# EAGLE design opto-mount (EAGLE 5.04)
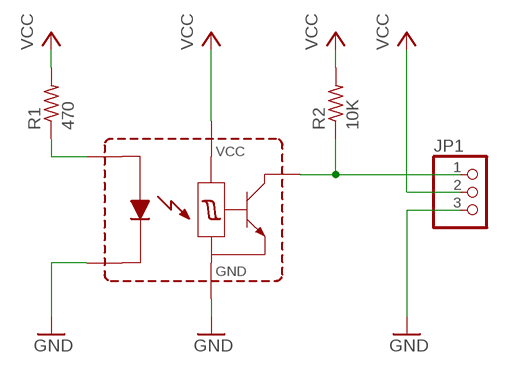
[diagram p0: schematic, sheet 1]

## Parts
JP1  PINHD-1X3  [1X03]
R1  470  R-US_R0805  [R0805]
R2  10K  R-US_R0402  [R0402]
U$1  H21LOB  [H21L]

## Nets
GND: JP1.3 U$1.P$2(K) U$1.P$5(GND)
N$1: R1.1 U$1.P$1(A)
N$2: JP1.1 R2.1 U$1.P$4(OUT)
VCC: JP1.2 R1.2 R2.2 U$1.P$3(VCC)

## Library data of the parts
JP1 = pinhead:PINHD-1X3: PIN HEADER
R1 R2 = rcl:R-US_: RESISTOR, American symbol
U$1 = H21L:H21LOB

## Board
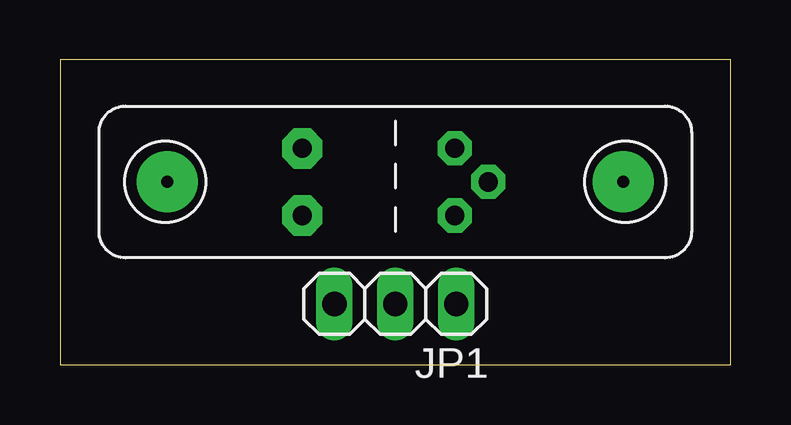
[diagram p1: board, top side]
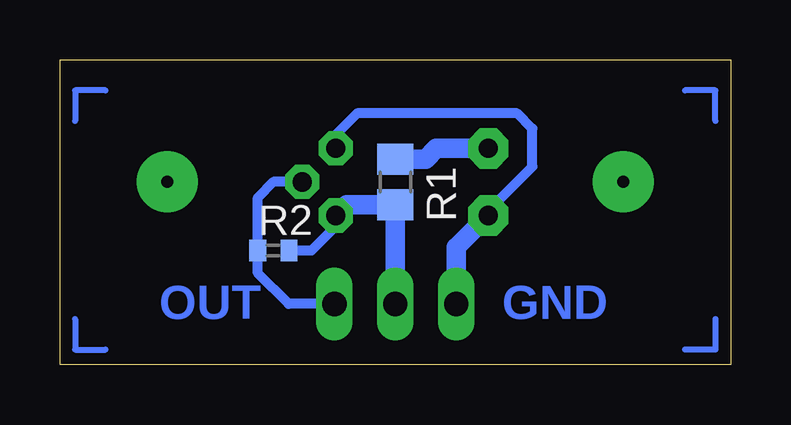
[diagram p2: board, bottom side, seen from below]

Size 27.94 x 12.7 mm. Coordinates in mm from the lower left corner, seen from the top.
Outline: 0,0 27.94,0 27.94,12.7 0,12.7 0,0
Copper layers (1*16): Top 0.035mm / dielectric 1.5mm / Bottom 0.035mm
Design rules "default *": minimum track width 12mil, minimum drill 24mil, track to track 16mil, track to pad 16mil, pad to pad 16mil, via to via 16mil, smd to smd 8mil, copper to edge 40mil, drill to drill 8mil, minimum pad ring 10mil, minimum via ring 8mil, stop-mask expansion 4mil, vias tented up to drill 0mil, thermal gap 10mil

### Footprints (pad centres in the part's own frame; a part is rotated, then mirrored left to right if it is on the bottom)
1X03 = drill 1.016 long: 1 -2.54,0; 2 0,0; 3 2.54,0
R0805 = smd 1.3 x 1.5: 1 -0.95,0; 2 0.95,0
R0402 = smd 0.7 x 0.9: 1 -0.65,0; 2 0.65,0
H21L = drill 0.8 pad 1.676 octagon: P$1 -3.873,1.397; P$2 -3.873,-1.397 | drill 0.8 pad 1.422 octagon: P$3 2.477,-1.397; P$4 3.873,0; P$5 2.477,1.397

### Placement (x,y rotation side)
JP1  13.97,2.54 180 top
R1  13.97,7.62 270 bottom
R2  19.05,4.76 0 bottom
U$1  13.97,7.62 0 top

### Tracks (layer width: path | path; a pad name or v marks a point on that pad's centre or on a via)
GND
  Bottom 0.406: U$1.P$2 10.1,6.41 8.26,8.26 8.26,9.84 8.89,10.48 15.56,10.48 16.45,9.59 U$1.P$5
  Bottom 0.813: JP1.3 11.43,4.89 U$1.P$2
N$1
  Bottom 0.813: R1.1 12.7,8.57 12.26,9.02 U$1.P$1
N$2
  Bottom 0.406: JP1.1 18.41,2.54 19.7,3.82 R2.1 19.7,6.97 19.05,7.62 U$1.P$4
N$3
  Bottom 0.254: 0.64,10.16 0.64,11.43 1.9,11.43
N$4
  Bottom 0.254: 0.64,1.9 0.64,0.64 1.9,0.64
N$5
  Bottom 0.254: 26.04,11.43 27.3,11.43 27.3,10.16
N$6
  Bottom 0.254: 27.3,1.9 27.3,0.64 26.04,0.64
N$7  (via drill 0.5 pad 2.54)
  other vias: 4.47,7.62
N$8  (via drill 0.5 pad 2.54)
  other vias: 23.47,7.62
VCC
  Bottom 0.406: R2.2 17.46,4.76 16.45,5.78 U$1.P$3
  Bottom 0.813: JP1.2 R1.2 16,6.67 U$1.P$3

### Text on the board
Bottom: GND | OUT